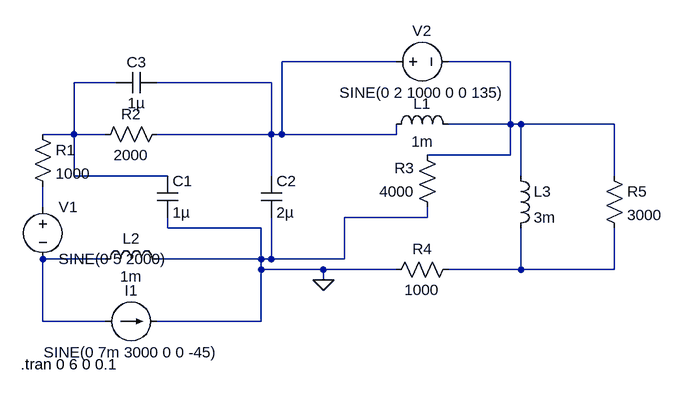
[diagram p0: schematic Draft1.asc]
Draft1.asc, the LTspice schematic file:
Version 4
SHEET 1 880 680
WIRE 400 32 224 32
WIRE 576 32 480 32
WIRE -32 64 -96 64
WIRE 208 64 32 64
WIRE 576 128 576 32
WIRE 576 128 480 128
WIRE 592 128 576 128
WIRE 736 128 592 128
WIRE -96 144 -96 64
WIRE -96 144 -144 144
WIRE -48 144 -96 144
WIRE 208 144 208 64
WIRE 208 144 32 144
WIRE 224 144 224 32
WIRE 224 144 208 144
WIRE 400 144 400 128
WIRE 400 144 224 144
WIRE 576 176 576 128
WIRE 576 176 448 176
WIRE -96 208 -96 144
WIRE 48 208 -96 208
WIRE 208 208 208 144
WIRE 592 208 592 128
WIRE 736 208 736 128
WIRE -144 256 -144 224
WIRE 448 272 448 256
WIRE 448 272 320 272
WIRE 48 288 48 272
WIRE 192 288 48 288
WIRE -48 336 -144 336
WIRE 192 336 192 288
WIRE 192 336 32 336
WIRE 208 336 208 272
WIRE 208 336 192 336
WIRE 320 336 320 272
WIRE 320 336 208 336
WIRE 192 352 192 336
WIRE 288 352 192 352
WIRE 400 352 288 352
WIRE 592 352 592 288
WIRE 592 352 480 352
WIRE 736 352 736 288
WIRE 736 352 592 352
WIRE 288 368 288 352
WIRE -144 432 -144 336
WIRE -48 432 -144 432
WIRE 192 432 192 352
WIRE 192 432 32 432
FLAG 288 368 0
SYMBOL cap 32 208 R0
SYMATTR InstName C1
SYMATTR Value 1µ
SYMBOL cap 192 208 R0
SYMATTR InstName C2
SYMATTR Value 2µ
SYMBOL cap 32 48 R90
WINDOW 0 0 32 VBottom 2
WINDOW 3 32 32 VTop 2
SYMATTR InstName C3
SYMATTR Value 1µ
SYMBOL ind 384 144 R270
WINDOW 0 32 56 VTop 2
WINDOW 3 5 56 VBottom 2
SYMATTR InstName L1
SYMATTR Value 1m
SYMBOL ind -64 352 R270
WINDOW 0 32 56 VTop 2
WINDOW 3 5 56 VBottom 2
SYMATTR InstName L2
SYMATTR Value 1m
SYMBOL ind 576 192 R0
SYMATTR InstName L3
SYMATTR Value 3m
SYMBOL res -160 128 R0
SYMATTR InstName R1
SYMATTR Value 1000
SYMBOL res 48 128 R90
WINDOW 0 0 56 VBottom 2
WINDOW 3 32 56 VTop 2
SYMATTR InstName R2
SYMATTR Value 2000
SYMBOL res 464 272 R180
WINDOW 0 36 76 Left 2
WINDOW 3 36 40 Left 2
SYMATTR InstName R3
SYMATTR Value 4000
SYMBOL res 384 368 R270
WINDOW 0 32 56 VTop 2
WINDOW 3 0 56 VBottom 2
SYMATTR InstName R4
SYMATTR Value 1000
SYMBOL res 720 192 R0
SYMATTR InstName R5
SYMATTR Value 3000
SYMBOL voltage -144 240 R0
WINDOW 123 0 0 Left 0
WINDOW 39 0 0 Left 0
SYMATTR InstName V1
SYMATTR Value SINE(0 5 2000)
SYMBOL voltage 384 32 R270
WINDOW 0 32 56 VTop 2
WINDOW 3 -32 56 VBottom 2
WINDOW 123 0 0 Left 0
WINDOW 39 0 0 Left 0
SYMATTR InstName V2
SYMATTR Value SINE(0 2 1000 0 0 135)
SYMBOL current -48 432 R270
WINDOW 0 32 40 VTop 2
WINDOW 3 -32 40 VBottom 2
WINDOW 123 0 0 Left 0
WINDOW 39 0 0 Left 0
SYMATTR InstName I1
SYMATTR Value SINE(0 7m 3000 0 0 -45)
TEXT -178 498 Left 2 !.tran 0 6 0 0.1

The netlist it stands for:
* Draft1.asc
C1 N003 0 1µ
C2 N001 0 2µ
C3 N001 N003 1µ
L1 N001 N002 1m
L2 N005 0 1m
L3 N002 N006 3m
R1 N003 N004 1000
R2 N001 N003 2000
R3 0 N002 4000
R4 0 N006 1000
R5 N002 N006 3000
V1 N004 N005 SINE(0 5 2000)
V2 N001 N002 SINE(0 2 1000 0 0 135)
I1 N005 0 SINE(0 7m 3000 0 0 -45)
.tran 0 6 0 0.1
.backanno
.end